# Altium schematic sheet Module.SchDoc
size A4
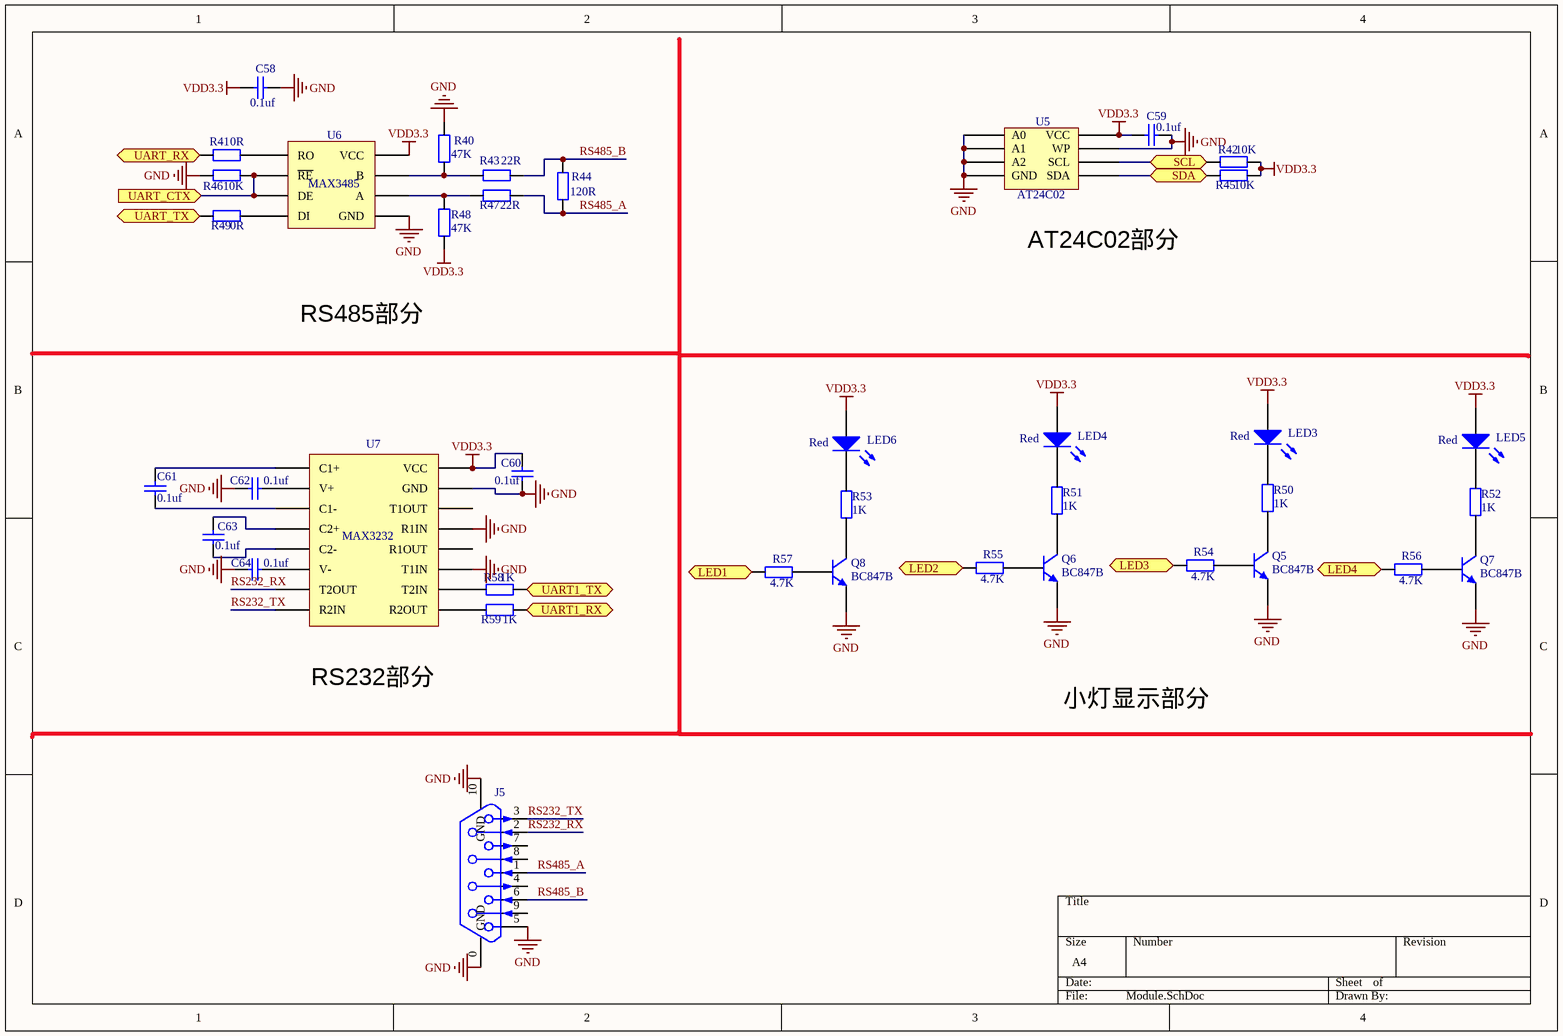
[diagram p0: Module.SchDoc]

## Parts
C58  value 0.1uf  [0603]  (hidden comment: Capacitor-0603)
C59  value 0.1uf  [0603]  (hidden comment: Capacitor-0603)
C60  value 0.1uf  [0603]  (hidden comment: Capacitor-0603)
C61  value 0.1uf  [0603]  (hidden comment: Capacitor-0603)
C62  value 0.1uf  [0603]  (hidden comment: Capacitor-0603)
C63  value 0.1uf  [0603]  (hidden comment: Capacitor-0603)
C64  value 0.1uf  [0603]  (hidden comment: Capacitor-0603)
J5  DB9  [DB9]  (value not drawn)
LED3  Color: Red  [外插小灯]  (hidden comment: LED)
LED4  Color: Red  [外插小灯]  (hidden comment: LED)
LED5  Color: Red  [外插小灯]  (hidden comment: LED)
LED6  Color: Red  [外插小灯]  (hidden comment: LED)
Q5  BC847  [BC847B]  (value not drawn)
Q6  BC847  [BC847B]  (value not drawn)
Q7  BC847  [BC847B]  (value not drawn)
Q8  BC847  [BC847B]  (value not drawn)
R40  value 47K  [0603]  (hidden comment: Resistor-0603)
R41  value 0R  [0603]  (hidden comment: Resistor-0603)
R42  value 10K  [0603]  (hidden comment: Resistor-0603)
R43  value 22R  [0603]  (hidden comment: Resistor-0603)
R44  value 120R  [0603]  (hidden comment: Resistor-0603)
R45  value 10K  [0603]  (hidden comment: Resistor-0603)
R46  value 10K  [0603]  (hidden comment: Resistor-0603)
R47  value 22R  [0603]  (hidden comment: Resistor-0603)
R48  value 47K  [0603]  (hidden comment: Resistor-0603)
R49  value 0R  [0603]  (hidden comment: Resistor-0603)
R50  value 1K  [0603]  (hidden comment: Resistor-0603)
R51  value 1K  [0603]  (hidden comment: Resistor-0603)
R52  value 1K  [0603]  (hidden comment: Resistor-0603)
R53  value 1K  [0603]  (hidden comment: Resistor-0603)
R54  value 4.7K  [0603]  (hidden comment: Resistor-0603)
R55  value 4.7K  [0603]  (hidden comment: Resistor-0603)
R56  value 4.7K  [0603]  (hidden comment: Resistor-0603)
R57  value 4.7K  [0603]  (hidden comment: Resistor-0603)
R58  value 1K  [0603]  (hidden comment: Resistor-0603)
R59  value 1K  [0603]  (hidden comment: Resistor-0603)
U5  AT24C02  [AT24C02]
U6  MAX3485  [MAX3485]
U7  MAX3232  [MAX3232]

## Ports
LED1 (in), LED2 (in), LED3 (in), LED4 (in), SCL, SDA, UART1_RX (out), UART1_TX (in), UART_CTX (in), UART_RX (out), UART_TX (in)

## Nets
GND: C58.2 C59.1 C60.1 C62.2 C64.2 J5.0(GND) J5.5 J5.10(GND) Q5.1(E) Q6.1(E) Q7.1(E) Q8.1(E) R40.2 R46.1 U5.1(A0) U5.2(A1) U5.3(A2) U5.4(GND) U5.7(WP) U6.5(GND) U7.11(T1IN) U7.13(R1IN) U7.15(GND)
VDD3.3: C58.1 C59.2 C60.2 LED3.1(A) LED4.1(A) LED5.1(A) LED6.1(A) R42.1 R45.1 R48.1 U5.8(VCC) U6.8(VCC) U7.16(VCC)
LED1: R57.2 ; port LED1
LED2: R55.2 ; port LED2
LED3: R54.2 ; port LED3
LED4: R56.2 ; port LED4
RS232_RX: J5.2 U7.7(T2OUT)
RS232_TX: J5.3 U7.8(R2IN)
RS485_A: J5.1 R44.2 R47.1
RS485_B: J5.6 R43.1 R44.1
SCL: R42.2 U5.6(SCL) ; port SCL
SDA: R45.2 U5.5(SDA) ; port SDA
UART1_RX: R59.1 ; port UART1_RX
UART1_TX: R58.1 ; port UART1_TX
UART_CTX: R46.2 U6.2(~{RE}) U6.3(DE) ; port UART_CTX
UART_RX: R41.1 ; port UART_RX
UART_TX: R49.1 ; port UART_TX
NetC61_1: C61.1 U7.3(C1-)
NetC61_2: C61.2 U7.1(C1+)
NetC62_1: C62.1 U7.2(V+)
NetC63_1: C63.1 U7.5(C2-)
NetC63_2: C63.2 U7.4(C2+)
NetC64_1: C64.1 U7.6(V-)
NetLED3_2: LED3.2 R50.2
NetLED4_2: LED4.2 R51.2
NetLED5_2: LED5.2 R52.2
NetLED6_2: LED6.2 R53.2
NetQ5_2: Q5.2(B) R54.1
NetQ5_3: Q5.3(C) R50.1
NetQ6_2: Q6.2(B) R55.1
NetQ6_3: Q6.3(C) R51.1
NetQ7_2: Q7.2(B) R56.1
NetQ7_3: Q7.3(C) R52.1
NetQ8_2: Q8.2(B) R57.1
NetQ8_3: Q8.3(C) R53.1
NetR40_1: R40.1 R43.2 U6.7(B)
NetR41_2: R41.2 U6.1(RO)
NetR47_2: R47.2 R48.2 U6.6(A)
NetR49_2: R49.2 U6.4(DI)
NetR58_2: R58.2 U7.10(T2IN)
NetR59_2: R59.2 U7.9(R2OUT)

Not connected (* = marked no-connect by the designer): J5 4 7 8 9; U7 12(R1OUT) 14(T1OUT)

## Notes on the sheet
- (near U5) AT24C02部分
- RS485部分
- RS232部分
- 小灯显示部分

## Library data of the parts
LED3-LED6 = LED: Value: LED
Q5-Q8 = BC847: Name: BC847B
U5 = AT24C02: Name: AT24C02
U6 = MAX3485: Name: MAX3485
U7 = MAX3232: Name: MAX3232